# EAGLE design hall (EAGLE 7.4.0)
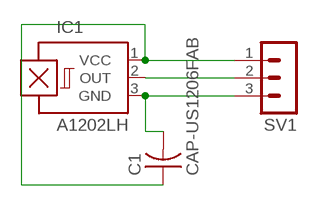
[diagram p0: schematic, sheet 1]

## Parts
C1  CAP-US1206FAB  [C1206FAB]
IC1  A1202LH  [SOT23-W]
SV1  MA03-1  [MA03-1]

## Nets
N$1: C1.1 IC1.1(VCC) SV1.1
N$2: IC1.2(OUT) SV1.2
N$3: C1.2 IC1.3(GND) SV1.3

## Library data of the parts
C1 = fab:CAP-US
IC1 = allegro:A12*?: Hall-effect bipolar switch Source: http://www.allegromicro.com/en/Products/Part_Numbers/1202/1202.pdf; OC_FARNELL: unknown; OC_NEWARK: unknown
SV1 = con-lstb:MA03-1: PIN HEADER; OC_FARNELL: unknown; OC_NEWARK: unknown

## Board
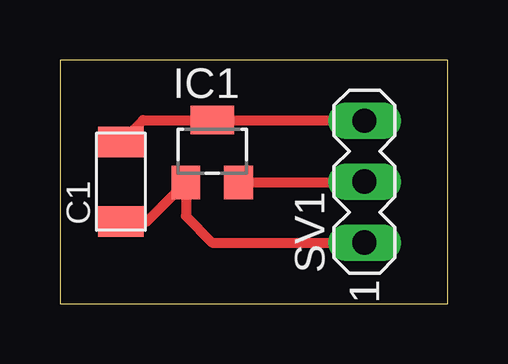
[diagram p1: board, top side]

Size 16.18 x 10.15 mm. Coordinates in mm from the lower left corner, seen from the top.
Outline: 0,0 16.18,0 16.18,10.15 0,10.15 0,0
Copper layers (1*16): Top 0.035mm / dielectric 1.5mm / Bottom 0.035mm
Design rules "default": minimum track width 10mil, minimum drill 24mil, track to track 8mil, track to pad 8mil, pad to pad 8mil, via to via 8mil, smd to smd 8mil, copper to edge 40mil, drill to drill 8mil, minimum pad ring 10mil, minimum via ring 8mil, stop-mask expansion 4mil, vias tented up to drill 0mil, thermal gap 10mil

### Footprints (pad centres in the part's own frame; a part is rotated, then mirrored left to right if it is on the bottom)
C1206FAB = smd 1.27 x 1.905: 1 -1.651,0; 2 1.651,0
SOT23-W = smd 1.2 x 1.4: 1 -1.1,-1.3; 2 1.1,-1.3 | smd 1.8 x 1.2: 3 0,1.3
MA03-1 = drill 1.016 long: 1 -2.54,0; 2 0,0; 3 2.54,0

### Placement (x,y rotation side)
C1  2.54,5.08 90 top
IC1  6.35,6.35 0 top
SV1  12.7,5.08 90 top

### Tracks (layer width: path | path; a pad name or v marks a point on that pad's centre or on a via)
N$1
  Top 0.406: C1.1 3.63,3.43 IC1.1 5.25,3.64 6.35,2.54 SV1.1
N$2
  Top 0.406: IC1.2 12.67,5.05 SV1.2
N$3
  Top 0.406: C1.2 3.46,7.65 IC1.3 12.67,7.65 SV1.3